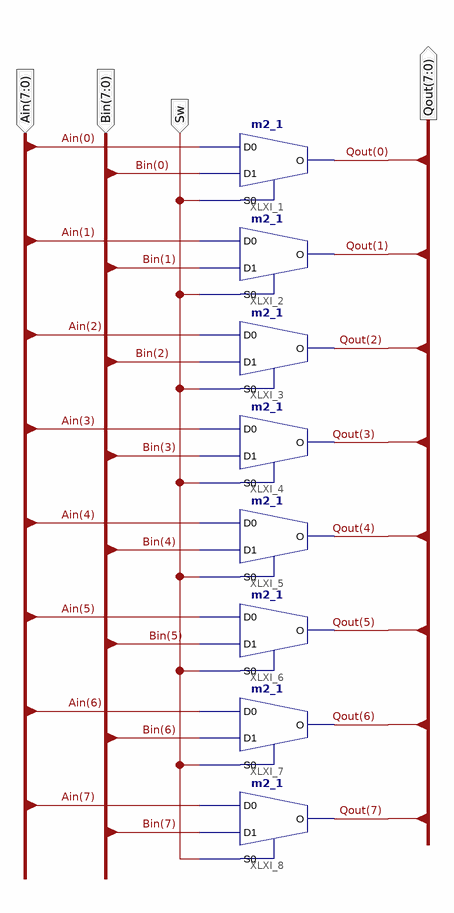
[diagram p0: schematic sheet 1]
// Xilinx ISE schematic eight_b_mux.sch (spartan3e) as structural Verilog: 8 symbols, 4 ports
module eight_b_mux (
  input  [7:0] Ain,
  input  [7:0] Bin,
  input  Sw,
  output [7:0] Qout
);

  m2_1 XLXI_1 (.D0(Ain[0]), .D1(Bin[0]), .S0(Sw), .O(Qout[0]));
  m2_1 XLXI_2 (.D0(Ain[1]), .D1(Bin[1]), .S0(Sw), .O(Qout[1]));
  m2_1 XLXI_3 (.D0(Ain[2]), .D1(Bin[2]), .S0(Sw), .O(Qout[2]));
  m2_1 XLXI_4 (.D0(Ain[3]), .D1(Bin[3]), .S0(Sw), .O(Qout[3]));
  m2_1 XLXI_5 (.D0(Ain[4]), .D1(Bin[4]), .S0(Sw), .O(Qout[4]));
  m2_1 XLXI_6 (.D0(Ain[5]), .D1(Bin[5]), .S0(Sw), .O(Qout[5]));
  m2_1 XLXI_7 (.D0(Ain[6]), .D1(Bin[6]), .S0(Sw), .O(Qout[6]));
  m2_1 XLXI_8 (.D0(Ain[7]), .D1(Bin[7]), .S0(Sw), .O(Qout[7]));
endmodule
